# Altium schematic sheet h bridge.SchDoc
size 1651 x 1651 mm; SheetNumber: 1; SheetTotal: 1
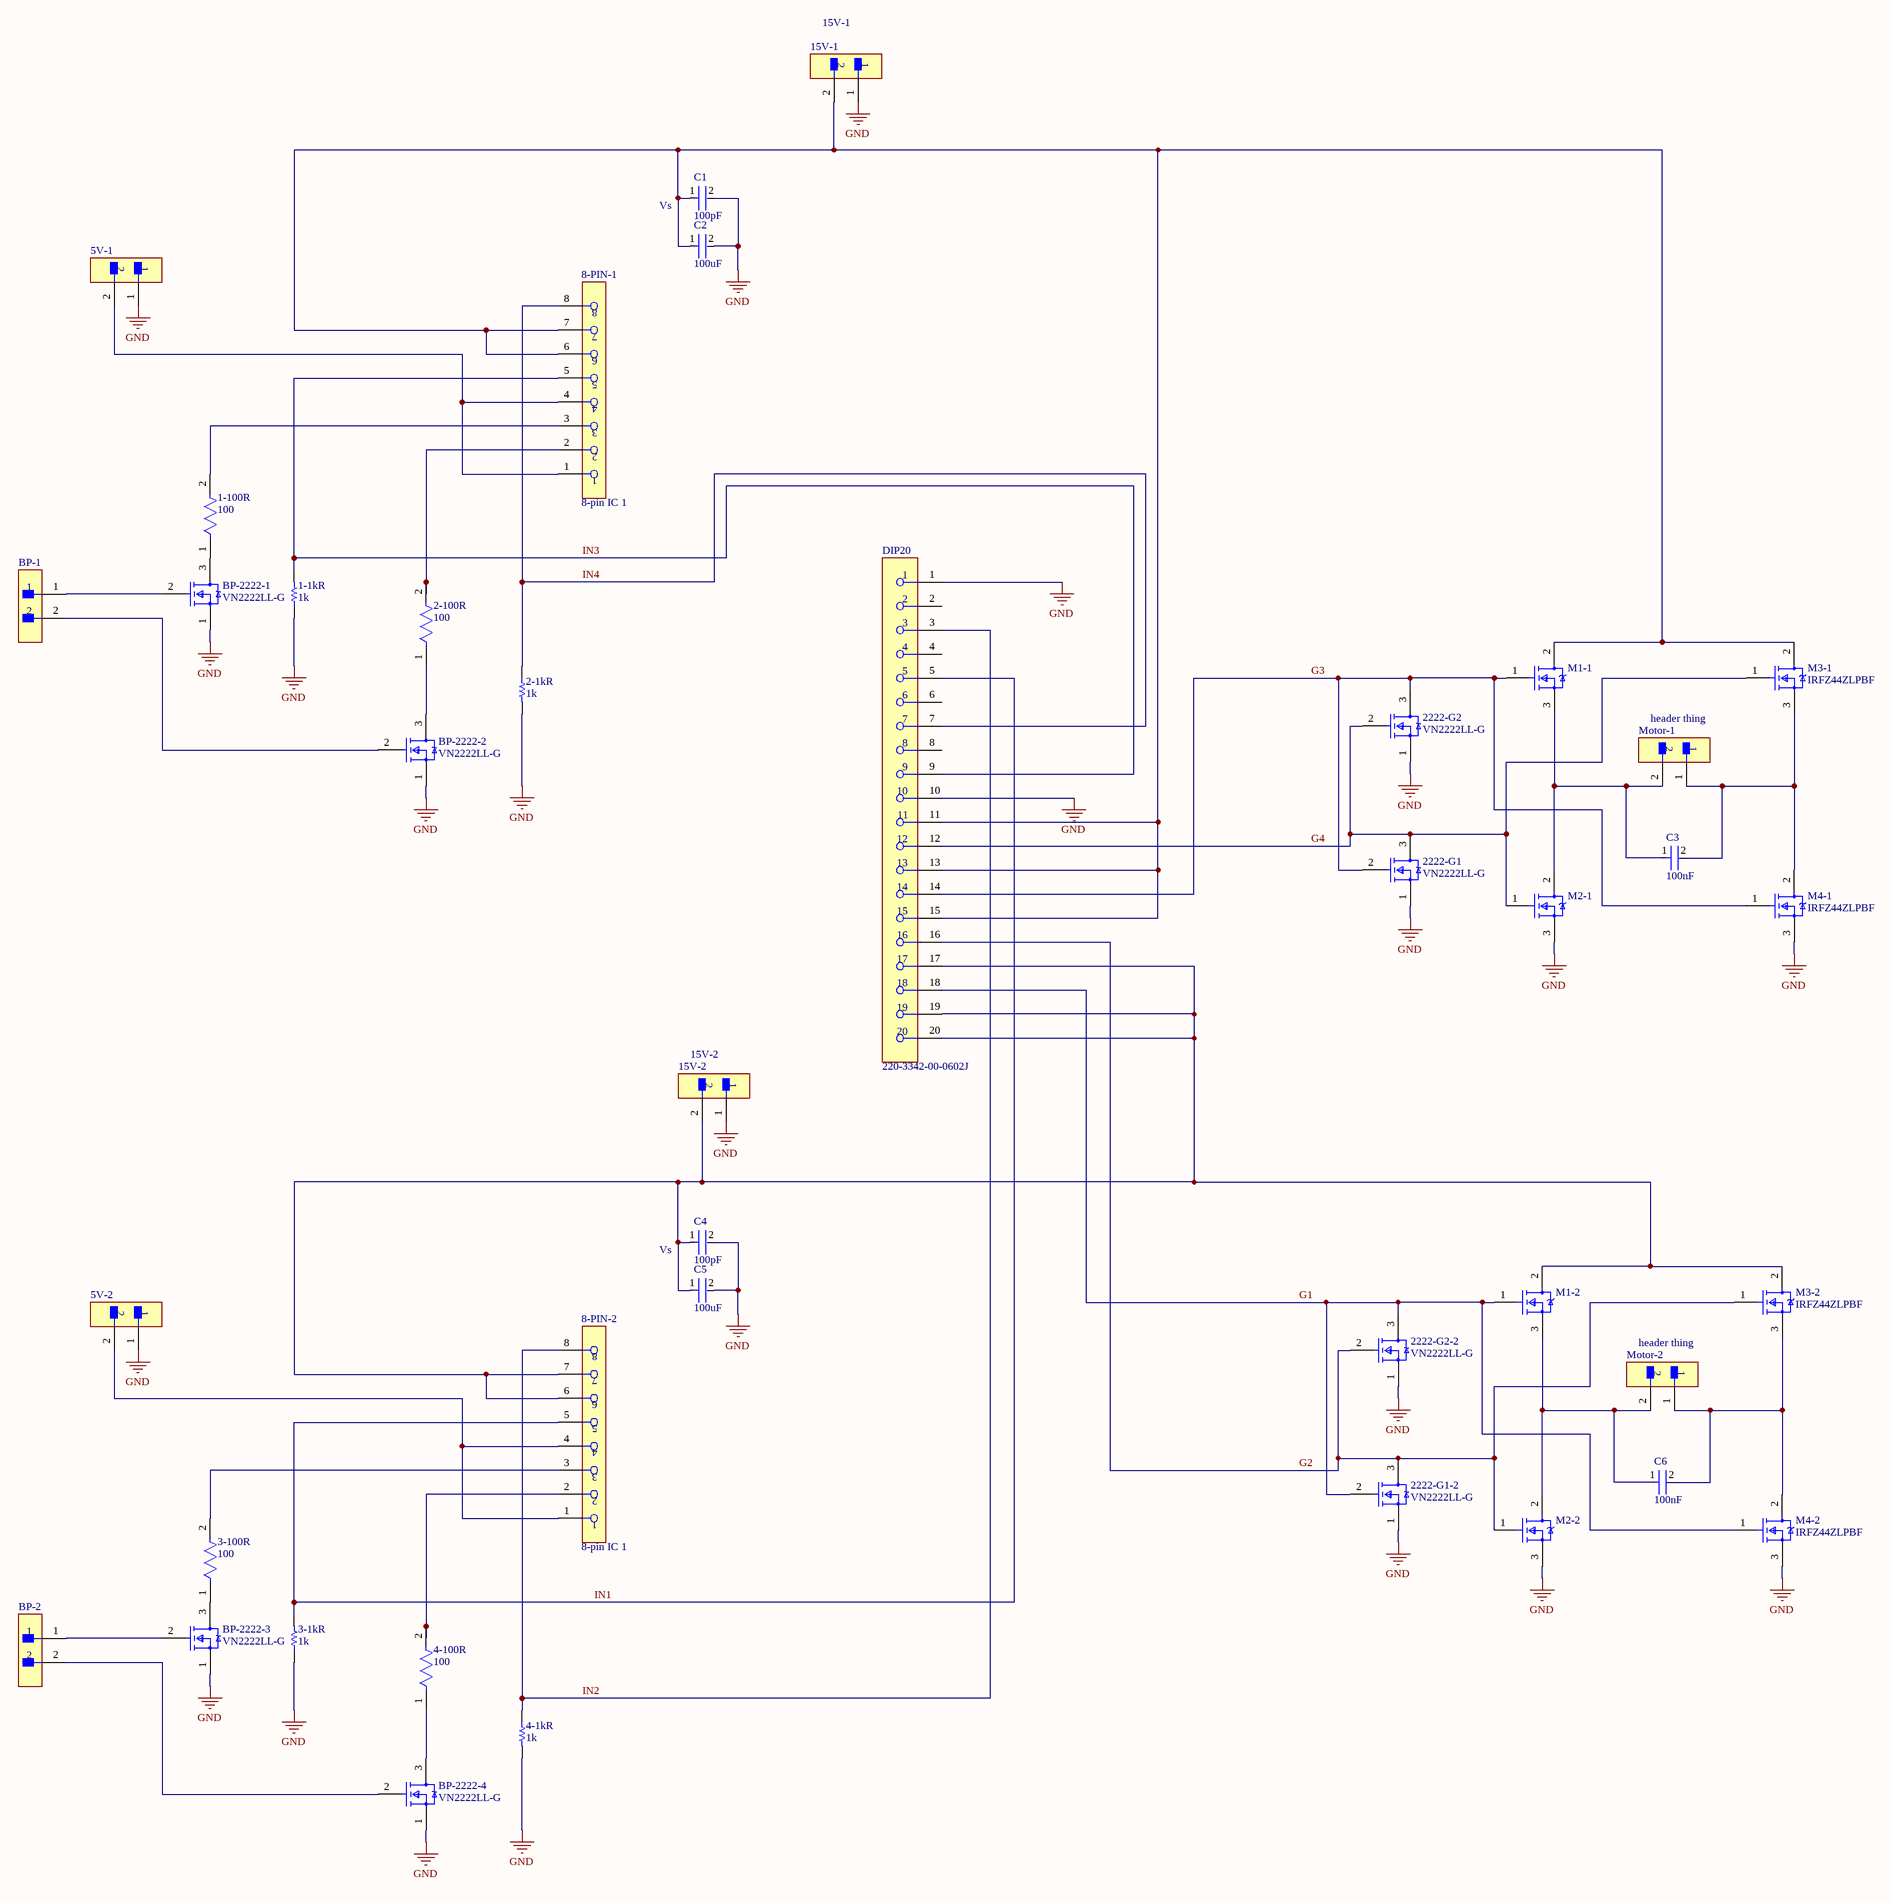
[diagram p0: h bridge.SchDoc]

## Parts
1-1kR  1k  [RESC3116X65X40ML10T20]
1-100R  100  [FP-CRCW1206-e3-MFG]
2-1kR  1k  [RESC3116X65X40ML10T20]
2-100R  100  [FP-CRCW1206-e3-MFG]
3-1kR  1k  [RESC3116X65X40ML10T20]
3-100R  100  [FP-CRCW1206-e3-MFG]
4-1kR  1k  [RESC3116X65X40ML10T20]
4-100R  100  [FP-CRCW1206-e3-MFG]
5V-1  (no value)  [FP-B2B-EH-A_LF_SN-MFG]
5V-2  (no value)  [FP-B2B-EH-A_LF_SN-MFG]
8-PIN-1  8-pin IC 1  [FP-1-2199298-2-MFG]
8-PIN-2  8-pin IC 1  [FP-1-2199298-2-MFG]
15V-1  15V-1  [FP-B2B-EH-A_LF_SN-MFG]
15V-2  15V-2  [FP-B2B-EH-A_LF_SN-MFG]
2222-G1  VN2222LL-G  [FP-VN2222LL-G-MFG]
2222-G1-2  VN2222LL-G  [FP-VN2222LL-G-MFG]
2222-G2  VN2222LL-G  [FP-VN2222LL-G-MFG]
2222-G2-2  VN2222LL-G  [FP-VN2222LL-G-MFG]
BP-1  (no value)  [FP-B2B-EH-A_LF_SN-MFG]
BP-2  (no value)  [FP-B2B-EH-A_LF_SN-MFG]
BP-2222-1  VN2222LL-G  [FP-VN2222LL-G-MFG]
BP-2222-2  VN2222LL-G  [FP-VN2222LL-G-MFG]
BP-2222-3  VN2222LL-G  [FP-VN2222LL-G-MFG]
BP-2222-4  VN2222LL-G  [FP-VN2222LL-G-MFG]
C1  100pF  [FP-1206-L_3_2_0_2-W_1_6_0-MFG]
C2  100uF  [FP-C3216-160-0_3-IPC_C]
C3  100nF  [FP-1206-L_3_2_0_2-W_1_6_0-IPC_C]
C4  100pF  [FP-1206-L_3_2_0_2-W_1_6_0-MFG]
C5  100uF  [FP-C3216-160-0_3-IPC_C]
C6  100nF  [FP-1206-L_3_2_0_2-W_1_6_0-IPC_C]
DIP20  220-3342-00-0602J  [FP-220-3342-00-0602J-0]
M1-1  IRFZ44ZLPBF  [FP-PG-TO262-3-MFG]  (value not drawn)
M1-2  IRFZ44ZLPBF  [FP-PG-TO262-3-MFG]  (value not drawn)
M2-1  IRFZ44ZLPBF  [FP-PG-TO262-3-MFG]  (value not drawn)
M2-2  IRFZ44ZLPBF  [FP-PG-TO262-3-MFG]  (value not drawn)
M3-1  IRFZ44ZLPBF  [FP-PG-TO262-3-MFG]
M3-2  IRFZ44ZLPBF  [FP-PG-TO262-3-MFG]
M4-1  IRFZ44ZLPBF  [FP-PG-TO262-3-MFG]
M4-2  IRFZ44ZLPBF  [FP-PG-TO262-3-MFG]
Motor-1  header thing  [FP-B2B-EH-A_LF_SN-MFG]
Motor-2  header thing  [FP-B2B-EH-A_LF_SN-MFG]

## Nets
GND: 1-1kR.1 2-1kR.2 3-1kR.1 4-1kR.2 5V-1.1 5V-2.1 15V-1.1 15V-2.1 2222-G1.1(SOURCE) 2222-G1-2.1(SOURCE) 2222-G2.1(SOURCE) 2222-G2-2.1(SOURCE) BP-2222-1.1(SOURCE) BP-2222-2.1(SOURCE) BP-2222-3.1(SOURCE) BP-2222-4.1(SOURCE) C1.2 C2.2 C4.2 C5.2 DIP20.1 DIP20.10 M2-1.3(S) M2-2.3(S) M4-1.3(S) M4-2.3(S)
G1: 2222-G1-2.2(GATE) 2222-G2-2.3(DRAIN) DIP20.18 M1-2.1(G) M4-2.1(G)
G2: 2222-G1-2.3(DRAIN) 2222-G2-2.2(GATE) DIP20.16 M2-2.1(G) M3-2.1(G)
G3: 2222-G1.2(GATE) 2222-G2.3(DRAIN) DIP20.14 M1-1.1(G) M4-1.1(G)
G4: 2222-G1.3(DRAIN) 2222-G2.2(GATE) DIP20.12 M2-1.1(G) M3-1.1(G)
IN1: 3-1kR.2 8-PIN-2.5 DIP20.5
IN2: 4-1kR.1 8-PIN-2.8 DIP20.3
IN3: 1-1kR.2 8-PIN-1.5 DIP20.9
IN4: 2-1kR.1 8-PIN-1.8 DIP20.7
Net1-100R_1: 1-100R.1 BP-2222-1.3(DRAIN)
Net1-100R_2: 1-100R.2 8-PIN-1.3
Net2-100R_1: 2-100R.1 BP-2222-2.3(DRAIN)
Net2-100R_2: 2-100R.2 8-PIN-1.2
Net3-100R_1: 3-100R.1 BP-2222-3.3(DRAIN)
Net3-100R_2: 3-100R.2 8-PIN-2.3
Net4-100R_1: 4-100R.1 BP-2222-4.3(DRAIN)
Net4-100R_2: 4-100R.2 8-PIN-2.2
Net5V-1_2: 5V-1.2 8-PIN-1.1 8-PIN-1.4
Net5V-2_2: 5V-2.2 8-PIN-2.1 8-PIN-2.4
Net8-PIN-1_6: 8-PIN-1.6 8-PIN-1.7 15V-1.2 C1.1 C2.1 DIP20.11 DIP20.13 DIP20.15 M1-1.2(D) M3-1.2(D)
Net8-PIN-2_6: 8-PIN-2.6 8-PIN-2.7 15V-2.2 C4.1 C5.1 DIP20.17 DIP20.19 DIP20.20 M1-2.2(D) M3-2.2(D)
NetBP-1_1: BP-1.1 BP-2222-1.2(GATE)
NetBP-1_2: BP-1.2 BP-2222-2.2(GATE)
NetBP-2_1: BP-2.1 BP-2222-3.2(GATE)
NetBP-2_2: BP-2.2 BP-2222-4.2(GATE)
NetC3_1: C3.1 M1-1.3(S) M2-1.2(D) Motor-1.2
NetC3_2: C3.2 M3-1.3(S) M4-1.2(D) Motor-1.1
NetC6_1: C6.1 M1-2.3(S) M2-2.2(D) Motor-2.2
NetC6_2: C6.2 M3-2.3(S) M4-2.2(D) Motor-2.1

Not connected (* = marked no-connect by the designer): DIP20 2 4 6 8

## Notes on the sheet
- (near C1) Vs
- (near C4) Vs

## Library data of the parts
1-1kR 2-1kR 3-1kR 4-1kR = CMP-2100-03678-1: Chip Resistor, 1 KOhm, +/- 1%, 0.25 W, -55 to 155 degC, 1206 (3216 Metric), RoHS, Tape and Reel; Manufacturer: Yageo; Temperature Coefficient: 100ppm/degreesC; Power Rating: 250mW; Voltage Rating: 200V; Resistance: 1KOhm; Composition: ThickFilm; Min Operating Temperature: -55degC; Tolerance: 1%; REACH SVHC: Unknown; Case Code (Metric): 3216; Military Standard: Not; Datasheet Version: Rev. 5, 10/2016; Package Reference: 1206.0; Case/Package: 1206; Length: 3.1mm; Manufacturer URL: http://www.yageo.com/; Lead Free: LeadFree; RoHSCompliant: true; Termination: SMD/SMT; Packaging: TapeandReel; Package Description: 2-Pin Surface Mount Device, Body 3.1 x 1.6 mm; Depth: 1.6mm; Case Code (Imperial): 1206; Max Operating Temperature: 155degC; Datasheet URL: http://www.yageo.com/NewPortal/yageodocoutput?fileName=/pdf/R-Chip/PYu-RC_Group_51_RoHS_L_5.pdf; Height: 0.55mm
1-100R 2-100R 3-100R 4-100R = CMP-2003-04801-2: RES Thick Film, 100Ω, 1%, 0.25W, 100ppm/°C, 1206; Voltage Rating (DC): 200V; Resistance: 100R; Power Rating: 250mW; Case Code (Metric): 3216; Radiation Hardening: No; Height: 0.55mm; Packaging: Tape and Reel; Depth: 1.6mm; Weight: 0.000353oz; Termination: SMD/SMT; Lead Free: Lead Free; Min Operating Temperature: -55°C; Contact Plating: Tin; Max Operating Temperature: 155°C; Case Code (Imperial): 1206; Military Standard: Not; Width: 1.6mm; Number of Pins: 2; Voltage Rating: 200V; Composition: Thick Film; Package Quantity: 5000; Tolerance: 1%; Case/Package: 1206; Mount: Surface Mount; Length: 3.2mm; Temperature Coefficient: 100ppm/°C
5V-1 5V-2 15V-1 15V-2 BP-1 BP-2 Motor-1 Motor-2 = CMP-17439-000026-1: CONN HEADER VERT 2POS 2.5MM; Number of Contacts: 2; Current Rating: 3A; Connector Type: Plug; Contact Resistance: 20mR; Gender: Male; Voltage Rating: 250V; Fastening Type: Detent; Depth: 3.8mm; Max Operating Temperature: 85°C; Orientation: Straight; Series: EH; Contact Plating: Tin; Min Operating Temperature: -25°C; Contact Type: Male Pin; Housing Color: White; Termination: Press-Fit; Housing Material: Nylon; Pitch: 2.5mm; Number of Positions: 2; Max Current Rating: 3A; Packaging: Bulk; Lead Free: Lead Free; Number of Rows: 1; Length: 7.5mm; Contact Mating Length: 0.13inch; Color: Natural; Max Voltage Rating (AC): 250V; Contact Material: Copper Alloy; Mount: Through Hole
8-PIN-1 8-PIN-2 = CMP-03370-000009-1: CONN IC DIP SOCKET 8POS TIN; Contact Post Length: 3inch; Number of Contacts: 8; Contact Current Rating: 1A; Contact Resistance: 20mR; Insulation Resistance: 1GR; Connector Type: Pin; Row Spacing: 0.3inch; Pitch: 2.54mm; Mating Alignment: Yes (With); RoHS Compliant: Yes; Packaging: Rail/Tube; Contact Material: Bronze; Lead Pitch: 2.54mm; Mount: Through Hole; Termination: Through Hole; Max Operating Temperature: 105°C; Flammability Rating: UL94 V-0; Package Quantity: 60; Contact Finish - Mating: TIN; ELV: Compliant; Radiation Hardening: No; Number of Rows: 2; Series: Diplomate DL; Color: Black; Number of Positions: 8; Contact Plating: Tin; Min Operating Temperature: -40°C; Lead Free: Lead Free; Length: 0.4inch; Orientation: Straight; Housing Material: PBT
2222-G1 2222-G1-2 2222-G2 2222-G2-2 BP-2222-1-BP-2222-4 = CMP-06369-000005-1: MOSFET N-CH 60V 0.23A TO92-3; Gate to Source Voltage (Vgs): 30V; Number of Elements: 1; Continuous Drain Current (ID): 230mA; Drain to Source Resistance: 7.5R; Element Configuration: Single; Power Dissipation: 1W; Max Operating Temperature: 150°C; Mount: Through Hole; Radiation Hardening: No; Lead Free: Lead Free; Number of Pins: 3; Packaging: Bulk; Package Quantity: 1000; Min Operating Temperature: -55°C; Case/Package: TO-92; Drain to Source Breakdown Voltage: 60V
C1 C4 = CMP-04427-007664-1: General Purpose Ceramic Capacitor, 1206, 100pF, 5%, NP0, 30ppm/°C, 100V; Dielectric: C0G; Insulation Resistance: 100GR; Voltage: 63V; Max Operating Temperature: 125°C; Termination: SMD/SMT; Radiation Hardening: No; Capacitance: 100pF; Voltage Rating: 100V; Thickness: 0.037inch; Temperature Coefficient: 30ppm/°C; Mount: Surface Mount; REACH SVHC: No SVHC; Case Code (Imperial): 1206; Voltage Rating (DC): 100V; Lead Free: Lead Free; RoHS Compliant: Yes; Height: 0.94mm; Number of Pins: 2; Case/Package: 1206; Package Quantity: 1; Series: -; Construction: Flat; Contact Plating: Tin; Tolerance: 5%; Length: 3.2mm; Min Operating Temperature: -55°C; Width: 0.063inch; Packaging: Tape and Reel; Case Code (Metric): 3216; Depth: 1.6mm
C2 C5 = CMP-2000-05396-3: Multilayer Ceramic Capacitors 100uF ±20% 10V X5R SMD 1206; Voltage Rating (DC): 10V; Length: 3.2mm; Mount: Surface Mount; Depth: 1.6mm; Width: 1.6mm; Package Quantity: 1; Min Operating Temperature: -55°C; Packaging: Tape and Reel; Max Operating Temperature: 85°C; Dielectric: X5R; Construction: Flat; Case Code (Imperial): 1206; Capacitance: 100uF; Thickness: 0.075inch; Radiation Hardening: No; RoHS Compliant: Yes; Series: C; Dielectric Material: Ceramic; Voltage: 10V; REACH SVHC: No SVHC; Case Code (Metric): 3216; Weight: 0.000571oz; Height: 1.6mm; Voltage Rating: 10V; Termination: SMD/SMT; Lead Free: Lead Free; Tolerance: 20%; Case/Package: 1206; Resistor Type: Ceramic
C3 C6 = CMP-04427-013576-1: General Purpose Ceramic Capacitor, 1206, 100nF, 5%, X7R, 15%, 100V; Max Operating Temperature: 125°C; Depth: 1.6mm; Package Quantity: 1; Thickness: 0.05inch; Number of Pins: 2; Height: 1.27mm; Voltage Rating (DC): 100V; Radiation Hardening: No; Termination: SMD/SMT; Construction: Flat; REACH SVHC: No SVHC; Case/Package: 1206; Case Code (Imperial): 1206; Tolerance: 5%; Width: 0.063inch; Voltage: 100V; Packaging: Tape and Reel; Voltage Rating: 100V; Case Code (Metric): 3216; Capacitance: 100nF; Min Operating Temperature: -55°C; Length: 3.2mm; Dielectric: X7R; Mount: Surface Mount; Dielectric Material: Ceramic; Contact Plating: Tin; RoHS Compliant: Yes; Lead Free: Lead Free; Series: -
DIP20 = CMP-05380-000001-1: CONN IC DIP SOCKET ZIF 20POS GLD; Manufacturer: 3M; Is Female: yes; Standoff Height: 0.38mm; Conn Orientation: Vertical; Description: 20 (2 x 10) Pos DIP, ZIF (ZIP), 0.3" (7.62mm) Row Spacing Socket Gold Connector; Number Of Contacts: 20; Conn Gender: Female; Socket Package: DIP20; Pitch: 2.54mm; Current Rating: 1A; Category: Conn; Temperature Range Low: -55°C; Package: 0; Device Class L3: unset; Temperature: -55°C to +125°C; Number Of Rows: 2; ComponentLink2Description: Datasheet; ComponentLink2URL: https://multimedia.3m.com/mws/media/494546O/3mtm-dip-sockets-100-2-54-mm-ts0365.pdf; Temperature Range High: +125°C; Digikey Description: CONN IC DIP SOCKET ZIF 20POS GLD; Mouser Description: IC & Component Sockets 0.100 DIP SOCKET 20 Contact Qty.; Manufacturer Part Number: 220-3342-00-0602J; Device Class L2: IC and Component Sockets; Octopart: https://octopart.com/220-3342-00-0602j-3m-108647; Device Class L1: Connectors; Contact Material: Gold,Nickel; Height: 24mm; Lead Free: Yes; RoHS: TRUE; Automotive: No
M1-1 M1-2 M2-1 M2-2 M3-1 M3-2 M4-1 M4-2 = CMP-32901-000428-1: MOSFET N-CH 55V 51A TO262; Input Capacitance: 1.42nF; Drain to Source Resistance: 13.9mR; Gate to Source Voltage (Vgs): 20V; Turn-Off Delay Time: 33ns; Power Dissipation: 80W; Element Configuration: Single; Turn-On Delay Time: 14ns; Continuous Drain Current (ID): 51A; Max Operating Temperature: 175°C; Max Dual Supply Voltage: 55V; Drain to Source Voltage (Vdss): 55V; RoHS Compliant: Yes; Halogen Free: Halogen Free; Rds On Max: 13.9mR; Mount: Through Hole; Width: 0.19inch; Min Operating Temperature: -55°C; Length: 0.419inch; Lead Free: Contains Lead; Max Power Dissipation: 80W; Packaging: Rail/Tube; Height: 0.355inch; Number of Pins: 3; Case/Package: TO-262